# Altium schematic sheet ЦТЕА4.324.039.SchDoc
size 420 x 297 mm; ApprovedBy: Соколов; CheckedBy: Крушинская; DrawnBy: Бунтов; DocumentNumber: ЦТЕА4.324.039 Э3; SheetNumber: {}; SheetTotal: {}; Title1str: Плата управления; PageSetup: Record=PageOptions|CenterHorizontal=False|CenterVertical=False|PrintScale=0.95|XCorrection=0.00|YCorrection=0.00|PrintKind=1|BorderSize=5000000|LeftOffset=0|BottomOffset=0|Orientation=1|PaperLength=1000|PaperWidth=1000|Scale=100|PaperSource=15|PrintQuality=600|MediaType=1|DitherType=10|PaperKind=A4|PrintScaleMode=1; Title2str: и индикации телеметрии; ProcessInspection: Кудряшова; DocumentType1str: Схема электрическая; DocumentType2str: принципиальная; ImagePath: ЦТЕА4.324.039; Rule: PcbType=ProtelPcb
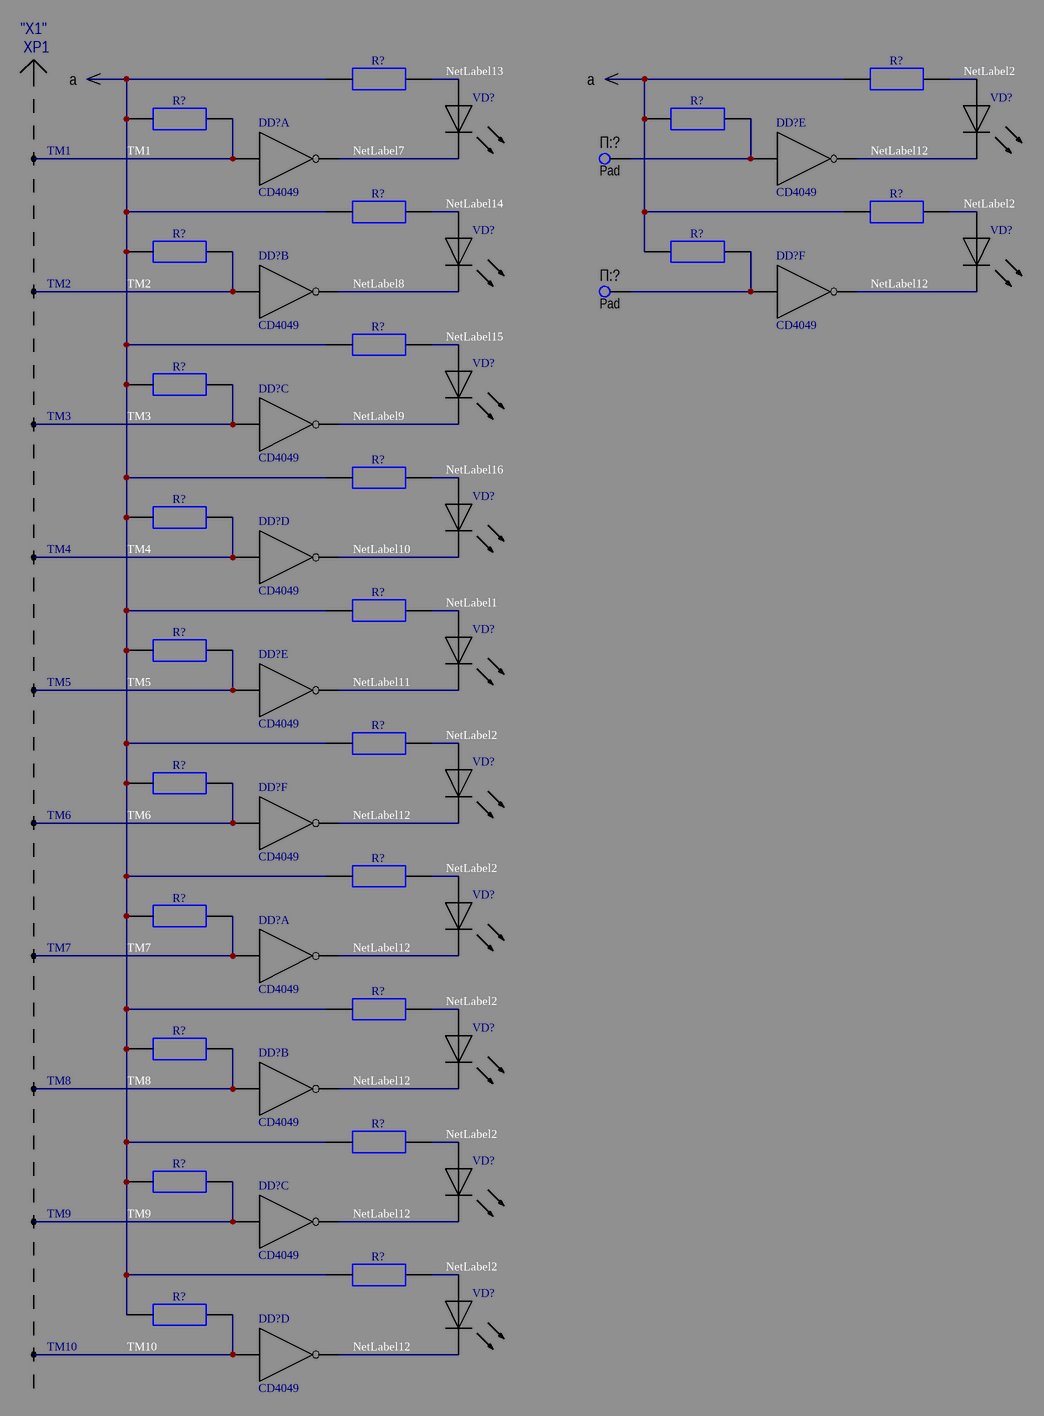
[diagram p0: ЦТЕА4.324.039.SchDoc]

## Parts
(Parts that share a designator on the sheet are numbered #1, #2 ... from top to bottom, then left to right.)
DD?#1  CD4049  [CD4049UBD]  (part A of 6)
DD?#2  CD4049  [CD4049UBD]  (part E of 6)
DD?#3  CD4049  [CD4049UBD]  (part B of 6)
DD?#4  CD4049  [CD4049UBD]  (part F of 6)
DD?#5  CD4049  [CD4049UBD]  (part C of 6)
DD?#6  CD4049  [CD4049UBD]  (part D of 6)
DD?#7  CD4049  [CD4049UBD]  (part E of 6)
DD?#8  CD4049  [CD4049UBD]  (part F of 6)
DD?#9  CD4049  [CD4049UBD]  (part A of 6)
DD?#10  CD4049  [CD4049UBD]  (part B of 6)
DD?#11  CD4049  [CD4049UBD]  (part C of 6)
DD?#12  CD4049  [CD4049UBD]  (part D of 6)
R?#1  Res  [R1-12_Om]  (value not drawn)
R?#2  Res  [R1-12_Om]  (value not drawn)
R?#3  Res  [R1-12_Om]  (value not drawn)
R?#4  Res  [R1-12_Om]  (value not drawn)
R?#5  Res  [R1-12_Om]  (value not drawn)
R?#6  Res  [R1-12_Om]  (value not drawn)
R?#7  Res  [R1-12_Om]  (value not drawn)
R?#8  Res  [R1-12_Om]  (value not drawn)
R?#9  Res  [R1-12_Om]  (value not drawn)
R?#10  Res  [R1-12_Om]  (value not drawn)
R?#11  Res  [R1-12_Om]  (value not drawn)
R?#12  Res  [R1-12_Om]  (value not drawn)
R?#13  Res  [R1-12_Om]  (value not drawn)
R?#14  Res  [R1-12_Om]  (value not drawn)
R?#15  Res  [R1-12_Om]  (value not drawn)
R?#16  Res  [R1-12_Om]  (value not drawn)
R?#17  Res  [R1-12_Om]  (value not drawn)
R?#18  Res  [R1-12_Om]  (value not drawn)
R?#19  Res  [R1-12_Om]  (value not drawn)
R?#20  Res  [R1-12_Om]  (value not drawn)
R?#21  Res  [R1-12_Om]  (value not drawn)
R?#22  Res  [R1-12_Om]  (value not drawn)
R?#23  Res  [R1-12_Om]  (value not drawn)
R?#24  Res  [R1-12_Om]  (value not drawn)
VD?#1  LED  (value not drawn)
VD?#2  LED  (value not drawn)
VD?#3  LED  (value not drawn)
VD?#4  LED  (value not drawn)
VD?#5  LED  (value not drawn)
VD?#6  LED  (value not drawn)
VD?#7  LED  (value not drawn)
VD?#8  LED  (value not drawn)
VD?#9  LED  (value not drawn)
VD?#10  LED  (value not drawn)
VD?#11  LED  (value not drawn)
VD?#12  LED  (value not drawn)
XP?#1  ТМ1  (part A of 20)
XP?#2  ТМ2  (part B of 20)
XP?#3  ТМ3  (part C of 20)
XP?#4  ТМ4  (part D of 20)
XP?#5  ТМ5  (part E of 20)
XP?#6  ТМ6  (part F of 20)
XP?#7  ТМ7  (part G of 20)
XP?#8  ТМ8  (part H of 20)
XP?#9  ТМ9  (part I of 20)
XP?#10  ТМ10  (part J of 20)
П:?#1  Pad
П:?#2  Pad

## Nets
+5V: DD?#1.1(Vcc) DD?#9.1(Vcc)
GND: DD?#1.8(Vss) DD?#9.8(Vss)
NetLabel1: R?#13.1 VD?#7.1
NetLabel2: R?#2.1 R?#6.1 R?#15.1 R?#17.1 R?#19.1 R?#21.1 R?#23.1 VD?#2.1 VD?#4.1 VD?#8.1 VD?#9.1 VD?#10.1 VD?#11.1 VD?#12.1
NetLabel7: DD?#1.2(G) VD?#1.1
NetLabel8: DD?#3.4(H) VD?#3.1
NetLabel9: DD?#5.6(I) VD?#5.1
NetLabel10: DD?#6.10(J) VD?#6.1
NetLabel11: DD?#7.12(K) VD?#7.1
NetLabel12: DD?#2.12(K) DD?#4.15(L) DD?#8.15(L) DD?#9.2(G) DD?#10.4(H) DD?#11.6(I) DD?#12.10(J) VD?#2.1 VD?#4.1 VD?#8.1 VD?#9.1 VD?#10.1 VD?#11.1 VD?#12.1
NetLabel13: R?#1.1 VD?#1.1
NetLabel14: R?#5.1 VD?#3.1
NetLabel15: R?#9.1 VD?#5.1
NetLabel16: R?#11.1 VD?#6.1
ТМ1: DD?#1.3(A) DD?#3.5(B) DD?#5.7(C) DD?#6.9(D) DD?#7.11(E) DD?#8.14(F) DD?#9.3(A) DD?#10.5(B) DD?#11.7(C) R?#1.1 R?#3.1 R?#5.1 R?#7.1 R?#9.1 R?#10.1 R?#11.1 R?#12.1 R?#13.1 R?#14.1 R?#15.1 R?#16.1 R?#17.1 R?#18.1 R?#19.1 R?#20.1 R?#21.1 R?#22.1 R?#23.1 R?#24.1 XP?#1.1 XP?#2.2 XP?#3.3 XP?#4.4 XP?#5.5 XP?#6.6 XP?#7.7 XP?#8.8 XP?#9.9  [also labelled ТМ2, ТМ3, ТМ4, ТМ5, ТМ6, ТМ7, ТМ8, ТМ9]
ТМ10: DD?#12.9(D) R?#24.1 XP?#10.10
NetDD?#2_11: DD?#2.11(E) R?#4.1 П:?#1.1
NetDD?#4_14: DD?#4.14(F) R?#8.1 П:?#2.1
NetR?#2_1: R?#2.1 R?#4.1 R?#6.1 R?#8.1

## Notes on the sheet
- "X1"
- XP1
- a
- Перв. примен.
- Справ. №
- Подп. и дата
- Инв. № дубл.
- Взам. инв. №
- Изм.
- Лист
- № докум.
- Подп.
- Дата
- Лит.
- Масса
- Масштаб
- ОЭБ
- Пров.
- Разраб.
- Листов
- Инв. № подл.
- Н.контр.
- Утв.
- Копировал
- Формат А3

## Library data of the parts
R?#1-R?#24 = R1-12_Om
VD?#1-VD?#12 = HLMP-D150
XP?#1-XP?#10 = PLD20: Наименование: *; Название: *